# EAGLE design Carte_elec (EAGLE 9.6.2)
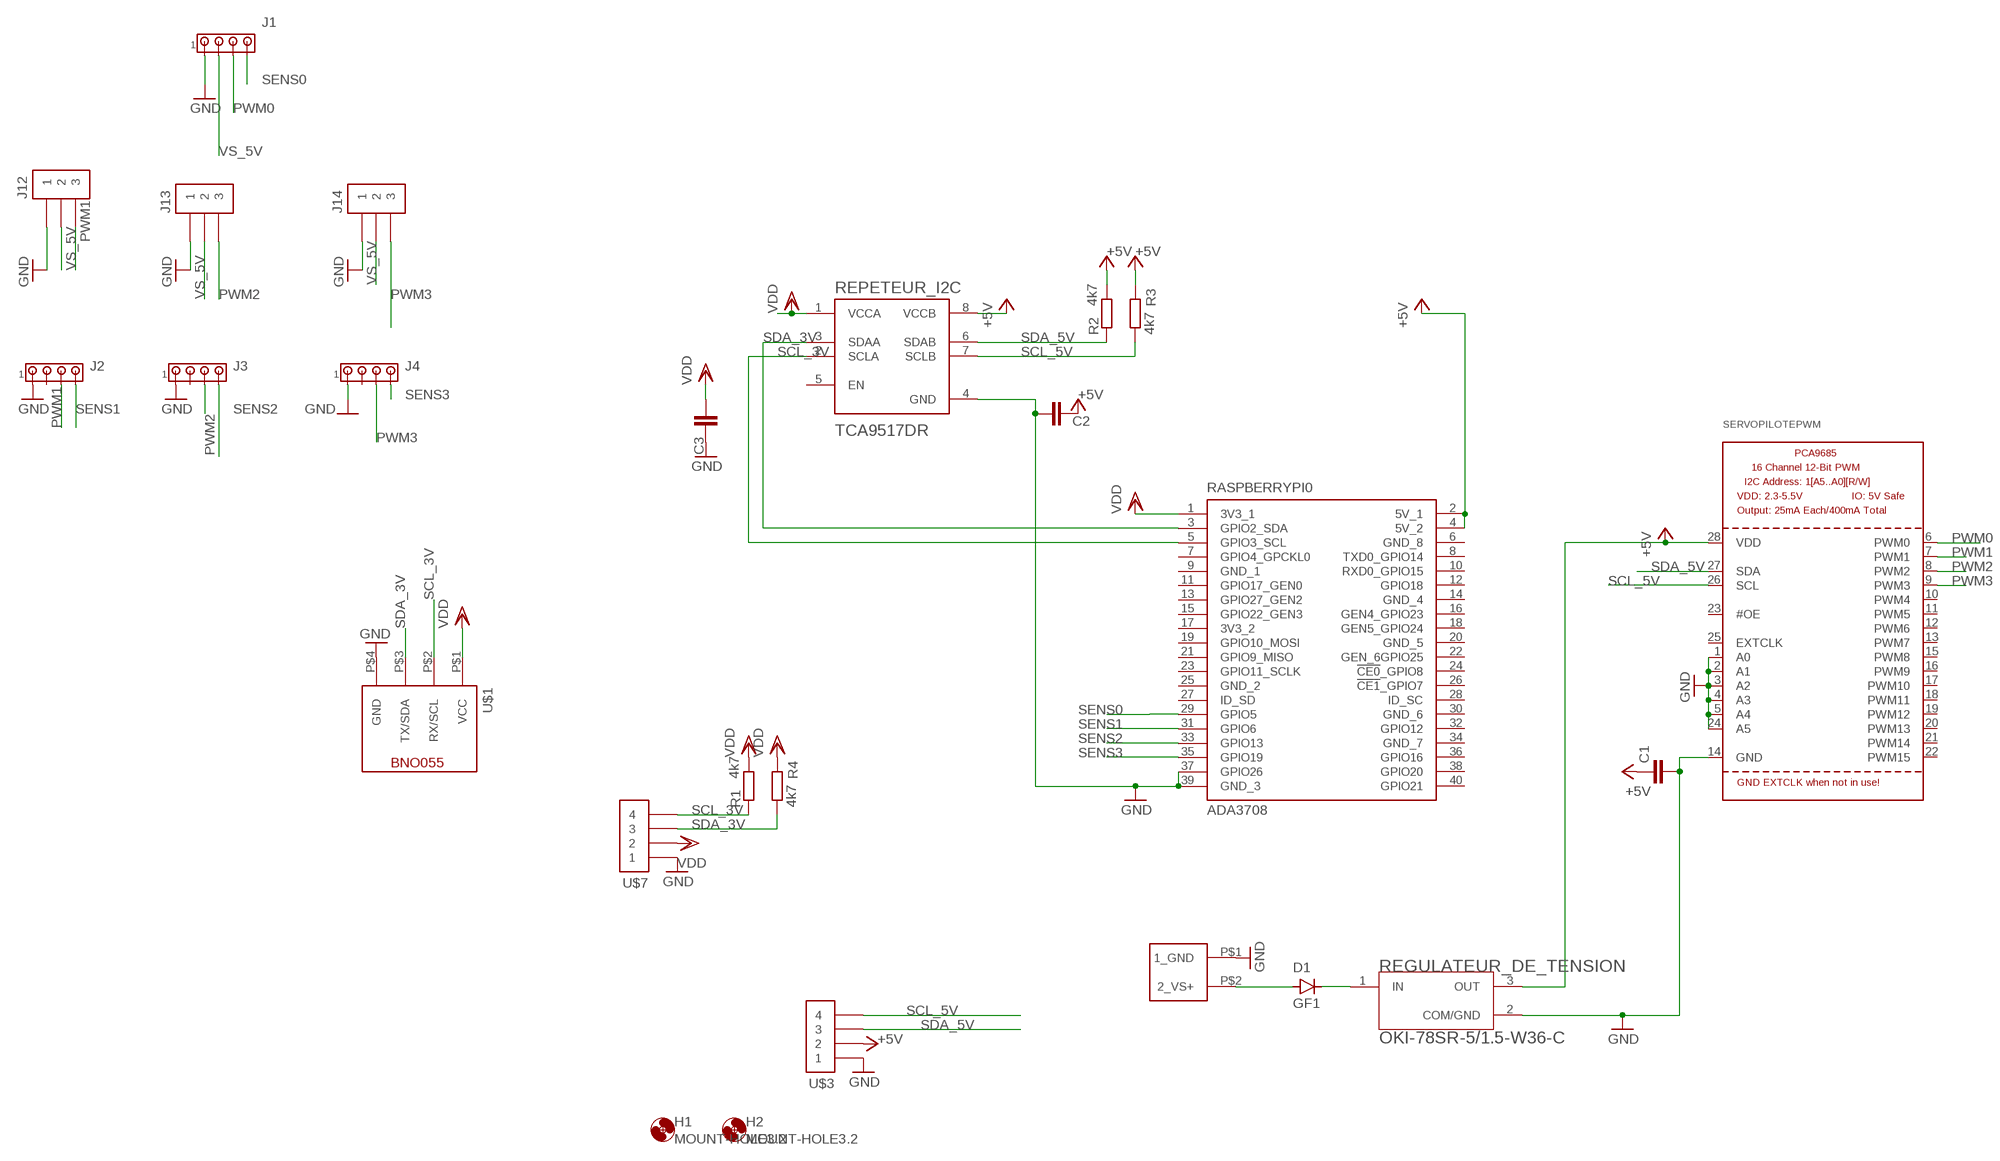
[diagram p0: schematic, sheet 1]

## Parts
C1  C-EUC1206  [C1206]
C2  C-EUC1206  [C1206]
C3  C-EUC1206  [C1206]
D1  GF1  [SMA-DO214AC]
H1  MOUNT-HOLE3.2  [3,2]
H2  MOUNT-HOLE3.2  [3,2]
J1  MTA04-100  [10X04MTA]
J2  MTA04-100  [10X04MTA]
J3  MTA04-100  [10X04MTA]
J4  MTA04-100  [10X04MTA]
J12  CAVALIER_3  [CAVALIER_3]
J13  CAVALIER_3  [CAVALIER_3]
J14  CAVALIER_3  [CAVALIER_3]
R1  4k7  R-EU_R1206  [R1206]
R2  4k7  R-EU_R1206  [R1206]
R3  4k7  R-EU_R1206  [R1206]
R4  4k7  R-EU_R1206  [R1206]
RASPBERRYPI0  ADA3708  [MODULE_ADA3708]
REGULATEUR_DE_TENSION  OKI-78SR-5/1.5-W36-C  [CONV_OKI-78SR-5/1.5-W36-C]
REPETEUR_I2C  TCA9517DR  [SOIC127P599X175-8N]
SERVOPILOTEPWM  PCA9685  [TSSOP28]
U$1  MODULE_BNO055  [MODULE_BNO055]
U$2  CONN_ALIM  [CONN_ALIM]
U$3  MOLEX_4_DROIT  [MOLEX_4_DROIT]
U$7  MOLEX_4_DROIT  [MOLEX_4_DROIT]

## Nets
+5V: C1.1 C2.1 R2.2 R3.2 RASPBERRYPI0.2(5V_1) RASPBERRYPI0.4(5V_2) REGULATEUR_DE_TENSION.3(OUT) REPETEUR_I2C.8(VCCB) SERVOPILOTEPWM.28(VDD) U$3.P$2
GND: C1.2 C2.2 C3.1 J1.1 J2.1 J3.1 J4.1 J12.P$1 J13.P$1 J14.P$1 RASPBERRYPI0.37(GPIO26) RASPBERRYPI0.39(GND_3) REGULATEUR_DE_TENSION.2(COM/GND) REPETEUR_I2C.4(GND) SERVOPILOTEPWM.1(A0) SERVOPILOTEPWM.2(A1) SERVOPILOTEPWM.3(A2) SERVOPILOTEPWM.4(A3) SERVOPILOTEPWM.5(A4) SERVOPILOTEPWM.14(GND) SERVOPILOTEPWM.24(A5) U$1.P$4(GND) U$2.P$1(1_GND) U$3.P$1 U$7.P$1
N$1: D1.A U$2.P$2(2_VS+)
N$2: J13.P$2
N$5: D1.K(C) REGULATEUR_DE_TENSION.1(IN)
PWM0: J1.3 SERVOPILOTEPWM.6(PWM0)
PWM1: J2.3 J12.P$3 SERVOPILOTEPWM.7(PWM1)
PWM2: J3.3 J13.P$3 SERVOPILOTEPWM.8(PWM2)
PWM3: J4.3 J14.P$3 SERVOPILOTEPWM.9(PWM3)
SCL_3V: R1.1 RASPBERRYPI0.5(GPIO3_SCL) REPETEUR_I2C.2(SCLA) U$1.P$2(RX/SCL) U$7.P$4
SCL_5V: R3.1 REPETEUR_I2C.7(SCLB) SERVOPILOTEPWM.26(SCL) U$3.P$4
SDA_3V: R4.1 RASPBERRYPI0.3(GPIO2_SDA) REPETEUR_I2C.3(SDAA) U$1.P$3(TX/SDA) U$7.P$3
SDA_5V: R2.1 REPETEUR_I2C.6(SDAB) SERVOPILOTEPWM.27(SDA) U$3.P$3
SENS0: J1.4 RASPBERRYPI0.29(GPIO5)
SENS1: J2.4 RASPBERRYPI0.31(GPIO6)
SENS2: J3.4 RASPBERRYPI0.33(GPIO13)
SENS3: J4.4 RASPBERRYPI0.35(GPIO19)
VDD: C3.2 R1.2 R4.2 RASPBERRYPI0.1(3V3_1) REPETEUR_I2C.1(VCCA) U$1.P$1(VCC) U$7.P$2
VS_5V: J1.2 J12.P$2 J14.P$2
Unconnected: J2.2 J3.2 J4.2 RASPBERRYPI0.7(GPIO4_GPCKL0) RASPBERRYPI0.8(TXD0_GPIO14) RASPBERRYPI0.10(RXD0_GPIO15) RASPBERRYPI0.11(GPIO17_GEN0) RASPBERRYPI0.12(GPIO18) RASPBERRYPI0.13(GPIO27_GEN2) RASPBERRYPI0.15(GPIO22_GEN3) RASPBERRYPI0.16(GEN4_GPIO23) RASPBERRYPI0.18(GEN5_GPIO24) RASPBERRYPI0.19(GPIO10_MOSI) RASPBERRYPI0.21(GPIO9_MISO) RASPBERRYPI0.22(GEN_6GPIO25) RASPBERRYPI0.23(GPIO11_SCLK) RASPBERRYPI0.24(!CE0!_GPIO8) RASPBERRYPI0.26(!CE1!_GPIO7) RASPBERRYPI0.27(ID_SD) RASPBERRYPI0.28(ID_SC) RASPBERRYPI0.32(GPIO12) RASPBERRYPI0.36(GPIO16) RASPBERRYPI0.38(GPIO20) RASPBERRYPI0.40(GPIO21) REPETEUR_I2C.5(EN) SERVOPILOTEPWM.10(PWM4) SERVOPILOTEPWM.11(PWM5) SERVOPILOTEPWM.12(PWM6) SERVOPILOTEPWM.13(PWM7) SERVOPILOTEPWM.15(PWM8) SERVOPILOTEPWM.16(PWM9) SERVOPILOTEPWM.17(PWM10) SERVOPILOTEPWM.18(PWM11) SERVOPILOTEPWM.19(PWM12) SERVOPILOTEPWM.20(PWM13) SERVOPILOTEPWM.21(PWM14) SERVOPILOTEPWM.22(PWM15) SERVOPILOTEPWM.23(#OE) SERVOPILOTEPWM.25(EXTCLK)

## Power pins joined to a net without a drawn wire
3V3_2: RASPBERRYPI0.17(3V3_2)
GND_1: RASPBERRYPI0.9(GND_1)
GND_2: RASPBERRYPI0.25(GND_2)
GND_4: RASPBERRYPI0.14(GND_4)
GND_5: RASPBERRYPI0.20(GND_5)
GND_6: RASPBERRYPI0.30(GND_6)
GND_7: RASPBERRYPI0.34(GND_7)
GND_8: RASPBERRYPI0.6(GND_8)

## Library data of the parts
C1-C3 = rcl:C-EU: CAPACITOR, European symbol; SPICEPREFIX: C
D1 = diode:GF1: DIODE
H1 H2 = holes:MOUNT-HOLE: MOUNTING HOLE with drill center marker
J1-J4 = con-amp:MTA04-100: AMP connector
J12-J14 = lib_ens_aj_v1:CAVALIER_3
R1-R4 = rcl:R-EU_: RESISTOR, European symbol; SPICEPREFIX: R
RASPBERRYPI0 = ADA3708:ADA3708: Check availability <https://pricing.snapeda.com/parts/ADA3708/Adafruit%20Industries/view-part?ref=eda>; AVAILABILITY: Not in stock; CHECK_PRICES: https://www.snapeda.com/parts/ADA3708/Adafruit+Industries+LLC/view-part/?ref=eda; DESCRIPTION: Raspberry Pi Zero WH (Zero W with Headers); MF: Adafruit Industries; MP: ADA3708; PACKAGE: None; PRICE: None; SNAPEDA_LINK: https://www.snapeda.com/parts/ADA3708/Adafruit+Industries+LLC/view-part/?ref=snap
REGULATEUR_DE_TENSION = OKI-78SR-5_1.5-W36-C:OKI-78SR-5/1.5-W36-C: OKI Series 8 W Single Output 5 V Non Isolated Through Hole DC/DC Converter Check availability <https://pricing.snapeda.com/parts/OKI-78SR-5/1.5-W36-C/Murata%20Power%20Solutions/view-part?ref=eda>; AVAILABILITY: In Stock; CHECK_PRICES: https://www.snapeda.com/parts/OKI-78SR-5/1.5-W36-C/Murata/view-part/?ref=eda; DESCRIPTION: Linear Regulator Replacement DC DC Converter 1 Output 5V - - - 1.5A 7V - 36V Input; MF: Murata Power Solutions; MP: OKI-78SR-5/1.5-W36-C; PACKAGE: None; PRICE: None; PURCHASE-URL: https://www.snapeda.com/api/url_track_click_mouser/?unipart_id=9305125&manufacturer=Murata Power Solutions&part_name=OKI-78SR-5/1.5-W36-C&search_term=oki-78sr; SNAPEDA_LINK: https://www.snapeda.com/parts/OKI-78SR-5/1.5-W36-C/Murata/view-part/?ref=snap
REPETEUR_I2C = TCA9517DR:TCA9517DR: Level-shifting I2C bus repeater 8-SOIC -40 to 85 Check availability <https://pricing.snapeda.com/parts/TCA9517DR/Texas%20Instruments/view-part?ref=eda>; AVAILABILITY: In Stock; CHECK_PRICES: https://www.snapeda.com/parts/TCA9517DR/Texas+Instruments/view-part/?ref=eda; DESCRIPTION: 2-bit level-translating 400-kHz I2C/SMBus buffer/repeater with powered-off high-impedance; MF: Texas Instruments; MP: TCA9517DR; PACKAGE: SOIC-8 Texas Instruments; PRICE: None; PURCHASE-URL: https://www.snapeda.com/api/url_track_click_mouser/?unipart_id=878996&manufacturer=Texas Instruments&part_name=TCA9517DR&search_term=tca 9517; SNAPEDA_LINK: https://www.snapeda.com/parts/TCA9517DR/Texas+Instruments/view-part/?ref=snap
SERVOPILOTEPWM = adafruit:PCA9685: PCA9685 - 16 Channel 12-Bit I2C PWM Controller 5.0V tolerant 16 channel, 12-bit I2C PWM controller with 25mA per output (max. 400mA total) Digikey: 568-5931-1-ND
U$1 = lib_ens_aj_v1:MODULE_BNO055
U$2 = lib_ens_aj_v1:CONN_ALIM
U$3 U$7 = lib_ens_aj_v1:MOLEX_4_DROIT

## Board
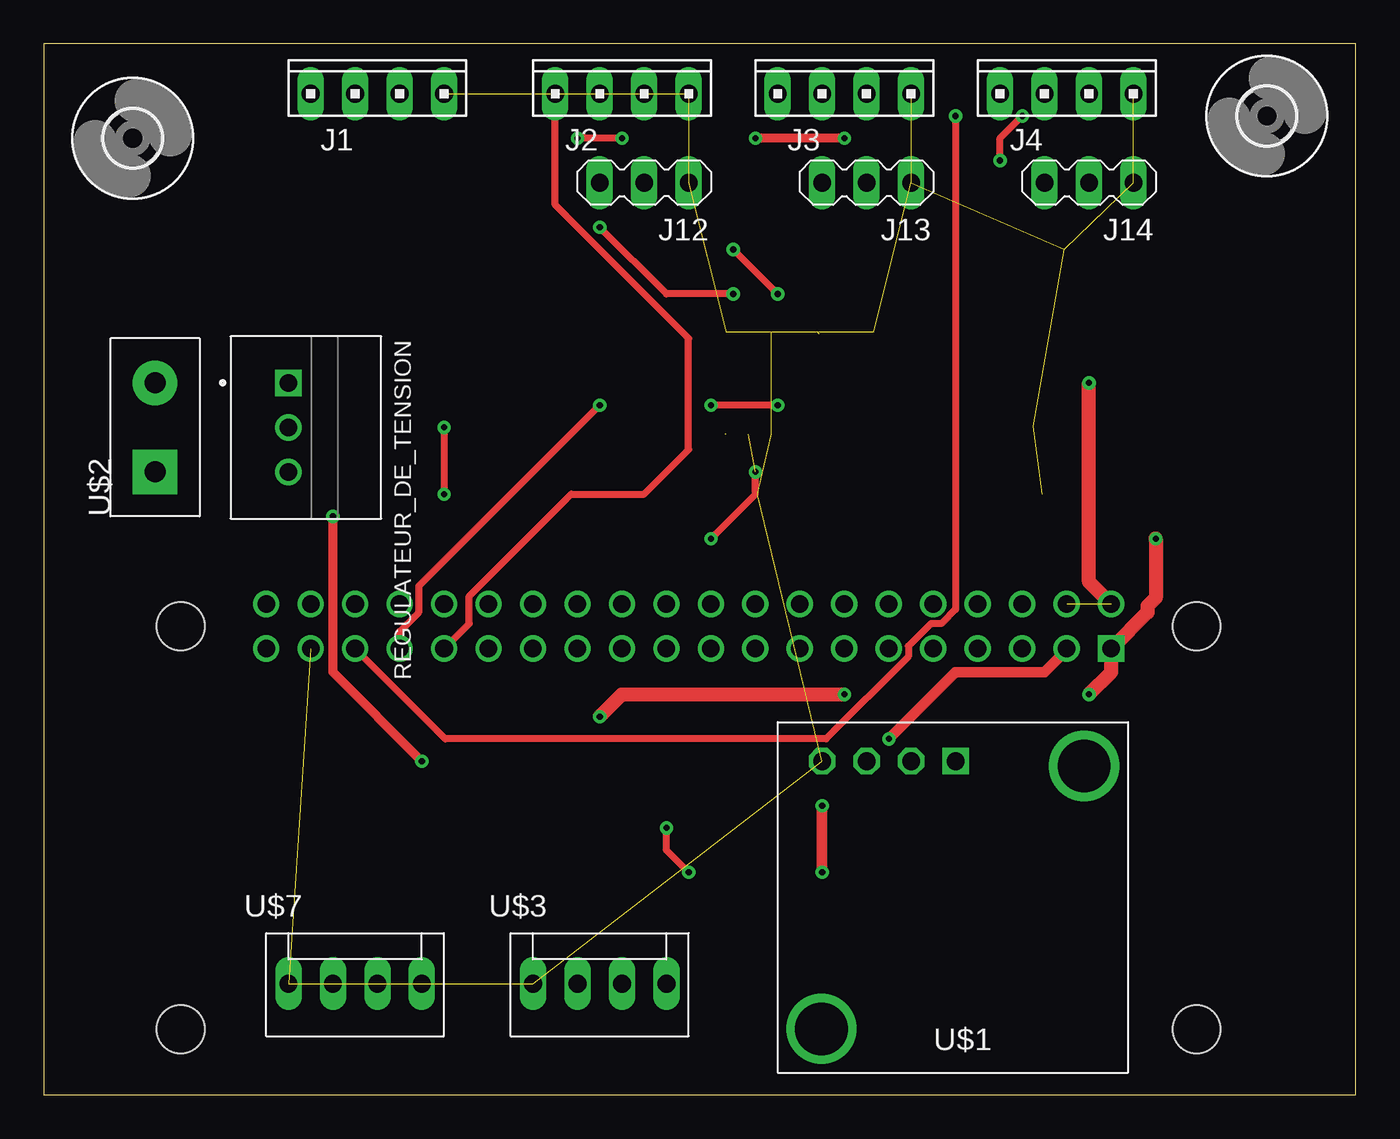
[diagram p1: board, top side]
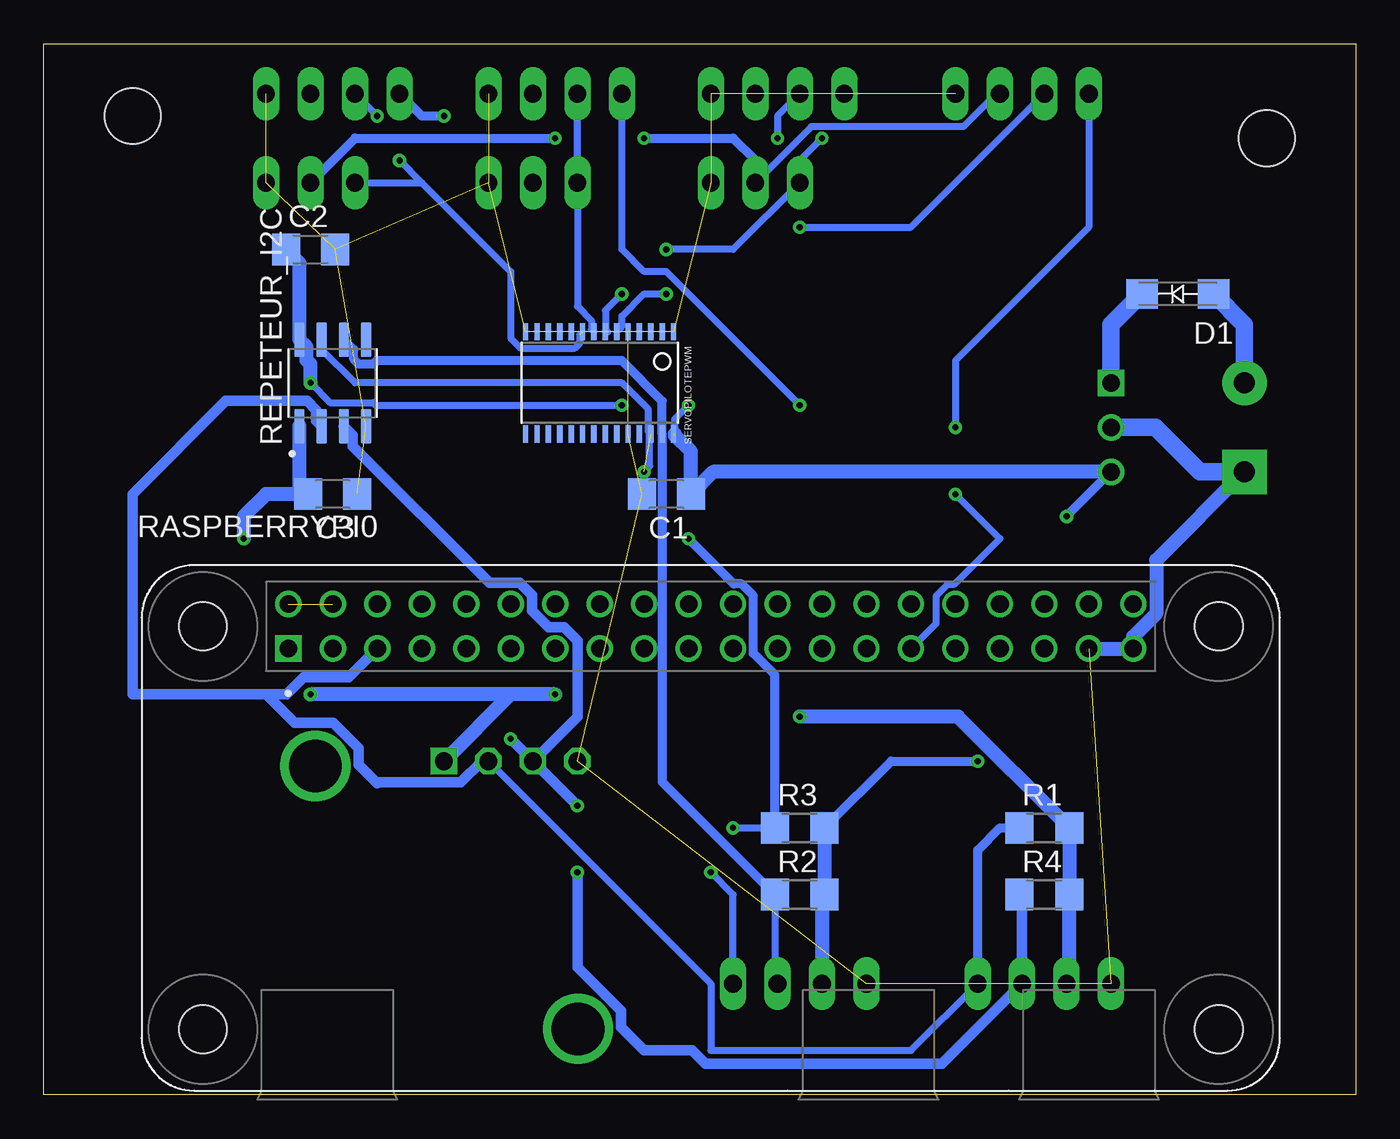
[diagram p2: board, bottom side, seen from below]

Size 74.92 x 60 mm. Coordinates in mm from the lower left corner, seen from the top.
Outline: 0,0 74.92,0 74.92,60 0,60 0,0
Copper layers (1*16): Top 0.035mm / dielectric 1.5mm / Bottom 0.035mm
Design rules "default *": minimum track width 10mil, minimum drill 0.35mm, track to track 10mil, track to pad 6mil, pad to pad 6mil, via to via 6mil, smd to smd 6mil, copper to edge 40mil, drill to drill 6mil, minimum pad ring 10mil, minimum via ring 8mil, stop-mask expansion 4mil, vias tented up to drill 0mil, thermal gap 10mil

### Footprints (pad centres in the part's own frame; a part is rotated, then mirrored left to right if it is on the bottom)
C1206 = smd 1.6 x 1.8: 1 -1.4,0; 2 1.4,0
SMA-DO214AC = smd 1.8 x 1.7: A -2.05,0; K 2.05,0
3,2 = hole 3.2: 0,0
10X04MTA = drill 1.016 long: 1 3.81,0; 2 1.27,0; 3 -1.27,0; 4 -3.81,0
CAVALIER_3 = drill 1.016 pad 1.5 long: P$1 -2.54,0; P$2 0,0; P$3 2.54,0
R1206 = smd 1.6 x 1.803: 1 -1.422,0; 2 1.422,0
MODULE_ADA3708 = drill 1 square: 1 -24.13,10.23 | drill 1: 2 -24.13,12.77; 3 -21.59,10.23; 4 -21.59,12.77; 5 -19.05,10.23; 6 -19.05,12.77; 7 -16.51,10.23; 8 -16.51,12.77; 9 -13.97,10.23; 10 -13.97,12.77; 11 -11.43,10.23; 12 -11.43,12.77; 13 -8.89,10.23; 14 -8.89,12.77; 15 -6.35,10.23; 16 -6.35,12.77; 17 -3.81,10.23; 18 -3.81,12.77; 19 -1.27,10.23; 20 -1.27,12.77; 21 1.27,10.23; 22 1.27,12.77; 23 3.81,10.23; 24 3.81,12.77; 25 6.35,10.23; 26 6.35,12.77; 27 8.89,10.23; 28 8.89,12.77; 29 11.43,10.23; 30 11.43,12.77; 31 13.97,10.23; 32 13.97,12.77; 33 16.51,10.23; 34 16.51,12.77; 35 19.05,10.23; 36 19.05,12.77; 37 21.59,10.23; 38 21.59,12.77; 39 24.13,10.23; 40 24.13,12.77 | hole 2.75: -29,-11.5; -29,11.5; 29,-11.5; 29,11.5
CONV_OKI-78SR-5/1.5-W36-C = drill 1 pad 1.5 square: 1 -2.54,0 | drill 1 pad 1.5: 2 0,0; 3 2.54,0
SOIC127P599X175-8N = smd 1.97 x 0.6: 1 -2.47,1.905; 2 -2.47,0.635; 3 -2.47,-0.635; 4 -2.47,-1.905; 5 2.47,-1.905; 6 2.47,-0.635; 7 2.47,0.635; 8 2.47,1.905
TSSOP28 = smd 0.305 x 0.991: 1 -4.225,-2.918; 2 -3.575,-2.918; 3 -2.925,-2.918; 4 -2.275,-2.918; 5 -1.625,-2.918; 6 -0.975,-2.918; 7 -0.325,-2.918; 8 0.325,-2.918; 9 0.975,-2.918; 10 1.625,-2.918; 11 2.275,-2.918; 12 2.925,-2.918; 13 3.575,-2.918; 14 4.225,-2.918; 15 4.225,2.918; 16 3.575,2.918; 17 2.925,2.918; 18 2.275,2.918; 19 1.625,2.918; 20 0.975,2.918; 21 0.325,2.918; 22 -0.325,2.918; 23 -0.975,2.918; 24 -1.625,2.918; 25 -2.275,2.918; 26 -2.925,2.918; 27 -3.575,2.918; 28 -4.225,2.918
MODULE_BNO055 = drill 1.016 pad 1.5 square: P$1 10.16,17.78 | drill 1.016 pad 1.5 octagon: P$2 7.62,17.78; P$3 5.08,17.78; P$4 2.54,17.78 | drill 3: P$5 17.5,17.5; P$6 2.5,2.5
CONN_ALIM = drill 1.2 pad 2.54 square: P$1 -2.54,0 | drill 1.2 pad 2.54: P$2 2.54,0
MOLEX_4_DROIT = drill 1.016 pad 1.5 long: P$1 -2.54,0; P$2 0,0; P$3 2.54,0; P$4 5.08,0

### Placement (x,y rotation side)
C1  39.37,34.29 180 bottom
C2  59.69,48.26 0 bottom
C3  58.42,34.29 180 bottom
D1  10.16,45.72 180 bottom
H1  5.08,54.61 0 top
H2  69.85,55.88 0 top
J1  19.05,57.15 0 top
J2  33.02,57.15 0 top
J3  45.72,57.15 0 top
J4  58.42,57.15 0 top
J12  34.29,52.07 180 top
J13  46.99,52.07 180 top
J14  59.69,52.07 180 top
R1  17.78,15.24 0 bottom
R2  31.75,11.43 0 bottom
R3  31.75,15.24 0 bottom
R4  17.78,11.43 0 bottom
RASPBERRYPI0  36.83,15.24 0 bottom
REGULATEUR_DE_TENSION  13.97,38.1 270 top
REPETEUR_I2C  58.42,40.64 90 bottom
SERVOPILOTEPWM  43.18,40.64 180 bottom
U$1  41.91,1.27 0 top
U$2  6.35,38.1 90 top
U$3  30.48,6.35 0 top
U$7  16.51,6.35 0 top

### Tracks (layer width: path | path; a pad name or v marks a point on that pad's centre or on a via)
+5V  (via drill 0.35)  (2 unrouted)
  Top 0.406: v41.91,39.37 v38.1,39.37
  Top 0.508: v21.59,19.05 16.51,24.13 v16.51,33.02
  Top 0.813: RASPBERRYPI0.2 59.69,29.28 v59.69,40.64
  Bottom 0.406: v41.91,39.37 55.97,39.37 56.11,39.51 58.56,39.51 v59.69,40.64 | v38.1,39.37 38.89,38.58 38.89,37.66
  Bottom 0.508: R3.2 26.52,19.05 v21.59,19.05 | v16.51,33.02 REGULATEUR_DE_TENSION.3
  Bottom 0.61: 30.33,6.5 U$3.P$2
  Bottom 0.813: REGULATEUR_DE_TENSION.3 36.7,35.56 C1.1 37.97,36.74 38.89,37.66 38.89,37.72 | C2.1 60.33,47.49 REPETEUR_I2C.8 59.92,42.7 59.92,41.94 59.69,41.71 v59.69,40.64 | R3.2 R2.2 30.48,11.28 U$3.P$2
GND  (21 unrouted)
  Bottom 0.813: U$2.P$1 11.39,30.52 11.39,27.47 12.7,26.15 RASPBERRYPI0.39 RASPBERRYPI0.37
  Bottom 1: U$2.P$1 8.89,35.56 11.43,38.1 REGULATEUR_DE_TENSION.2
N$1
  Bottom 1: U$2.P$2 6.35,43.96 D1.A
N$5
  Bottom 1: D1.K 13.97,43.96 REGULATEUR_DE_TENSION.1
PWM0  (via drill 0.35)
  Top 0.406: v39.37,45.72 35.56,45.72 v31.75,49.53
  Bottom 0.406: SERVOPILOTEPWM.6 41.91,43.85 41.91,44.45 40.64,45.72 v39.37,45.72 | v31.75,49.53 25.4,49.53 J1.3
PWM1  (via drill 0.35)  (1 unrouted)
  Top 0.406: v33.02,54.61 v30.48,54.61 | v39.37,48.26 v41.91,45.72
  Bottom 0.406: J2.3 33.02,55.88 v33.02,54.61 | v30.48,54.61 31.75,53.34 J12.P$3 35.56,48.26 v39.37,48.26 | v41.91,45.72 42.84,44.78 SERVOPILOTEPWM.7 42.71,43.56
PWM2
  Bottom 0.406: SERVOPILOTEPWM.8 43.65,43.7 43.65,44.2 44.45,45 J13.P$3 J3.3
PWM3  (via drill 0.35)  (1 unrouted)
  Top 0.406: v54.61,53.34 54.61,54.61 v55.88,55.88
  Bottom 0.406: J14.P$3 53.34,52.07 | 53.34,52.07 48.26,46.99 48.26,43.18 47.7,42.62 44.59,42.62 44.3,42.91 44.3,43.42 | 53.34,52.07 v54.61,53.34 | v55.88,55.88 J4.3 | 44.3,43.42
SCL_3V
  Bottom 0.406: U$1.P$2 36.83,6.35 36.83,2.54 25.4,2.54 U$7.P$4
  Bottom 0.508: U$7.P$4 21.59,13.97 20.32,15.24 R1.1
  Bottom 0.61: U$1.P$2 49.9,19.05 51.12,17.83 55.83,17.83 55.88,17.78 56.95,18.84 56.95,19.79 58.39,21.23 60.6,21.23 62.23,22.86 | 62.23,22.86 69.85,22.86 69.85,34.29 64.53,39.61 59.88,39.61 59.36,39.09 59.36,38.48 REPETEUR_I2C.2 | RASPBERRYPI0.5 57.52,23.82 60.09,23.82 61.05,22.86 62.23,22.86
SCL_5V  (via drill 0.35)  (1 unrouted)
  Top 0.406: v38.1,31.75 40.64,34.29 v40.64,35.56 | v36.83,12.7 35.56,13.97 v35.56,15.24
  Bottom 0.406: v40.64,35.56 40.32,35.88 40.32,37.78 40.4,37.86 40.4,39.13 41.91,40.64 57.15,40.64 59.05,42.55 REPETEUR_I2C.7 | U$3.P$4 35.56,11.43 v36.83,12.7 | v35.56,15.24 R3.1
  Bottom 0.508: v38.1,31.75 35.52,29.17 35.08,29.17 34.4,28.49 34.4,25.21 33.17,23.98 R3.1
SDA_3V  (via drill 0.35)
  Top 0.61: v44.45,12.7 v44.45,16.51 | v48.26,20.32 52.07,24.13 57.15,24.13 58.42,25.4 RASPBERRYPI0.3
  Bottom 0.61: U$1.P$3 v48.26,20.32 | REPETEUR_I2C.3 57.27,37.66 57.27,37.04 49.45,29.22 47.76,29.22 47.05,28.51 47.05,27.63 46.1,26.68 45.22,26.68 44.45,25.91 44.45,21.59 U$1.P$3 | R4.1 19.05,11.28 U$7.P$3 23.62,1.78 37.15,1.78 37.91,2.54 40.64,2.54 41.95,3.85 41.95,4.79 44.45,7.3 v44.45,12.7 | v44.45,16.51 U$1.P$3
SDA_5V
  Bottom 0.406: R2.1 33.17,6.5 U$3.P$3
  Bottom 0.508: R2.1 39.6,17.86 SERVOPILOTEPWM.27 39.6,39.6 41.91,41.91 55.9,41.91 56.09,41.72 56.94,41.72 57.22,42 57.22,42.55 REPETEUR_I2C.6
SENS0  (via drill 0.35)
  Top 0.406: v22.86,38.1 v22.86,34.29
  Bottom 0.406: J1.4 15.24,49.53 22.86,41.91 v22.86,38.1 | v22.86,34.29 20.32,31.75 22.95,29.12 23.32,29.12 23.97,28.47 23.97,26.9 RASPBERRYPI0.29
SENS1
  Top 0.406: RASPBERRYPI0.31 24.29,26.9 24.29,28.47 30.11,34.29 34.29,34.29 36.83,36.83 36.83,43.18 29.21,50.8 J2.4
SENS2  (via drill 0.35)
  Top 0.406: RASPBERRYPI0.33 20.32,26.44 21.43,27.55 21.43,29.05 v31.75,39.37
  Bottom 0.406: v31.75,39.37 39.37,46.99 40.64,46.99 41.91,48.26 J3.4
SENS3  (via drill 0.35)
  Top 0.406: RASPBERRYPI0.35 22.93,20.32 44.68,20.32 49.37,25.01 49.37,25.61 50.66,26.9 51.26,26.9 52.07,27.71 v52.07,55.88
  Bottom 0.508: J4.4 53.34,55.88 v52.07,55.88
VDD  (via drill 0.35)
  Top 0.813: v31.75,21.59 33.02,22.86 v45.72,22.86 | v59.69,22.86 60.96,24.13 RASPBERRYPI0.1 63.03,27.54 63.03,27.9 63.5,28.37 v63.5,31.75
  Bottom 0.813: U$7.P$2 16.36,6.5 R4.2 R1.2 22.71,21.59 v31.75,21.59 | U$1.P$1 48.26,22.86 v45.72,22.86 v59.69,22.86 | REPETEUR_I2C.1 60.33,34.8 C3.2 62.23,34.29 63.5,33.02 v63.5,31.75
VS_5V  (via drill 0.35)
  Top 0.508: v45.72,54.61 v40.64,54.61
  Bottom 0.406: J1.2 20.52,57.15 22.4,55.27 31.09,55.27 J12.P$2
  Bottom 0.508: J14.P$2 57.15,54.61 v45.72,54.61 | v40.64,54.61 35.56,54.61 34.29,53.34 J12.P$2